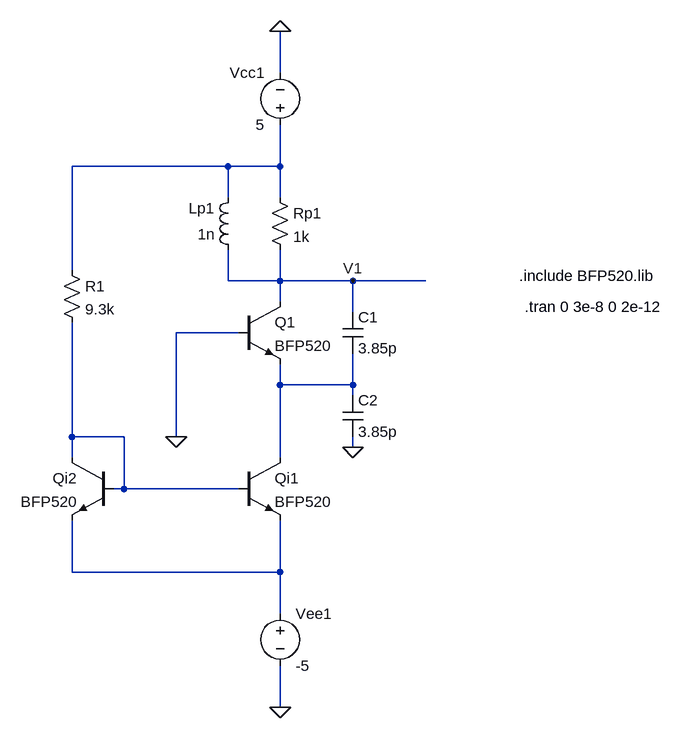
[diagram p0: schematic Operating-Point.asc]
Operating-Point.asc, the LTspice schematic file:
Version 4
SHEET 1 1628 832
WIRE 32 -160 32 -224
WIRE -48 -16 -288 -16
WIRE 32 -16 32 -80
WIRE 32 -16 -48 -16
WIRE -48 32 -48 -16
WIRE 32 32 32 -16
WIRE -288 144 -288 -16
WIRE -48 160 -48 112
WIRE 32 160 32 112
WIRE 32 160 -48 160
WIRE 144 160 32 160
WIRE 256 160 144 160
WIRE 32 192 32 160
WIRE 144 208 144 160
WIRE -32 240 -128 240
WIRE 32 320 32 288
WIRE 144 320 144 272
WIRE 144 320 32 320
WIRE 144 336 144 320
WIRE -288 400 -288 224
WIRE -208 400 -288 400
WIRE -128 400 -128 240
WIRE 144 416 144 400
WIRE -288 432 -288 400
WIRE 32 432 32 320
WIRE -208 480 -208 400
WIRE -208 480 -224 480
WIRE -32 480 -208 480
WIRE -288 608 -288 528
WIRE 32 608 32 528
WIRE 32 608 -288 608
WIRE 32 672 32 608
WIRE 32 816 32 752
FLAG 32 -224 0
FLAG 32 816 0
FLAG -128 400 0
FLAG 144 416 0
FLAG 144 160 V1
SYMBOL npn -32 192 R0
SYMATTR InstName Q1
SYMATTR Value BFP520
SYMBOL ind -32 128 R180
WINDOW 0 36 80 Left 2
WINDOW 3 36 40 Left 2
SYMATTR InstName Lp1
SYMATTR Value 1n
SYMBOL Res 16 16 R0
SYMATTR InstName Rp1
SYMATTR Value 1k
SYMBOL Voltage 32 -64 R180
WINDOW 0 24 96 Left 2
WINDOW 3 24 16 Left 2
SYMATTR InstName Vcc1
SYMATTR Value 5
SYMBOL npn -32 432 R0
SYMATTR InstName Qi1
SYMATTR Value BFP520
SYMBOL npn -224 432 M0
SYMATTR InstName Qi2
SYMATTR Value BFP520
SYMBOL Res -304 128 R0
SYMATTR InstName R1
SYMATTR Value 9.3k
SYMBOL Voltage 32 656 R0
SYMATTR InstName Vee1
SYMATTR Value -5
SYMBOL cap 128 208 R0
SYMATTR InstName C1
SYMATTR Value 3.85p
SYMBOL cap 128 336 R0
SYMATTR InstName C2
SYMATTR Value 3.85p
TEXT 400 152 Left 2 !.include BFP520.lib
TEXT 408 200 Left 2 !.tran 0 3e-8 0 2e-12

The netlist it stands for:
* Operating-Point.asc
Q1 V1 0 N002 0 BFP520
Lp1 V1 N001 1n
Rp1 N001 V1 1k
Vcc1 N001 0 5
Qi1 N002 N003 N004 0 BFP520
Qi2 N003 N003 N004 0 BFP520
R1 N001 N003 9.3k
Vee1 N004 0 -5
C1 V1 N002 3.85p
C2 N002 0 3.85p
.model NPN NPN
.model PNP PNP
.lib standard.bjt
.include BFP520.lib
.tran 0 3e-8 0 2e-12
.backanno
.end